# Altium schematic sheet headers.SchDoc
size B
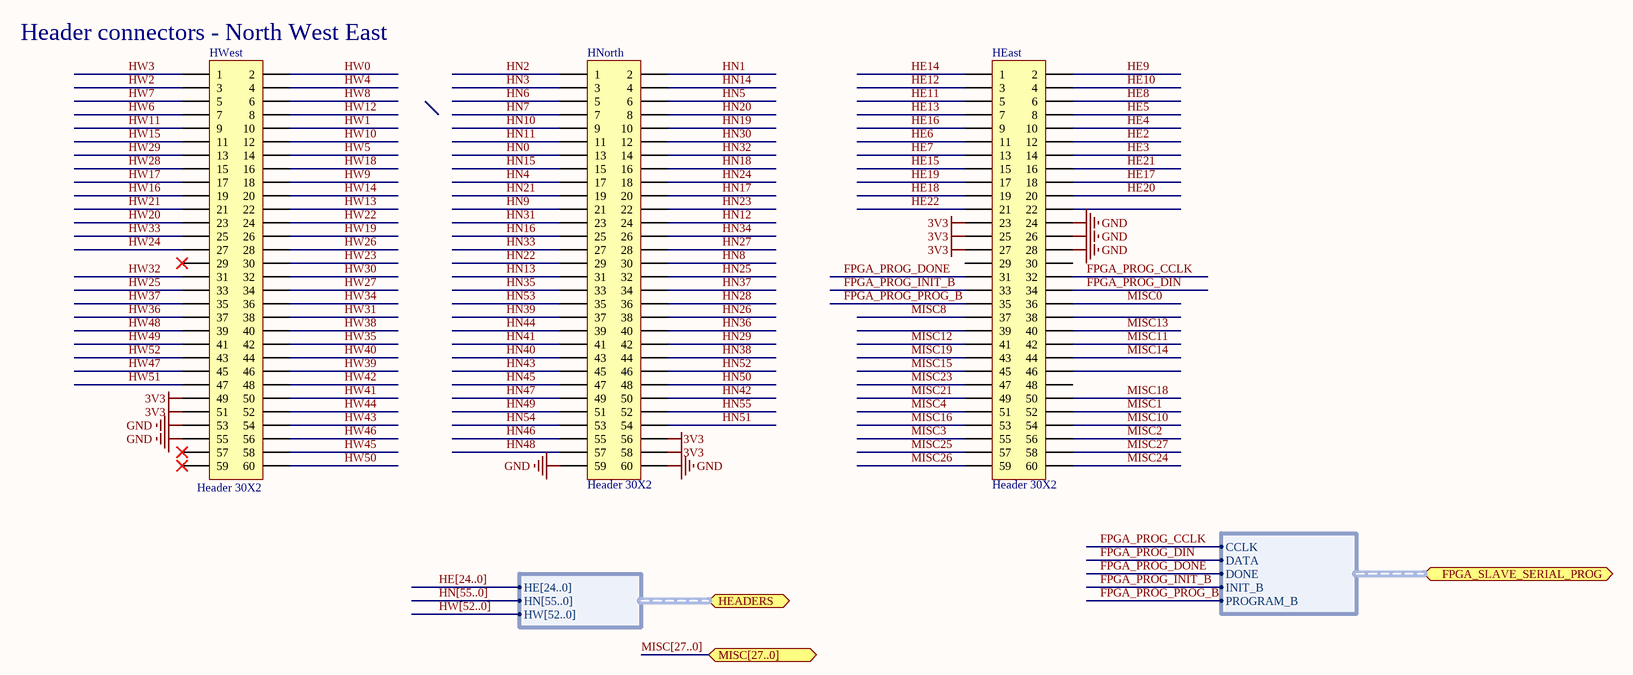
[diagram p0: headers.SchDoc]

## Parts
HEast  Header 30X2  [HDR2X30]
HNorth  Header 30X2  [HDR2X30]
HWest  Header 30X2  [HDR2X30]

## Ports
FPGA_SLAVE_SERIAL_PROG (harness FPGA_SLAVE_SERIAL_PROG), HEADERS (harness HEADERS), MISC[27..0]

## Harnesses
HEADERS: HE[24..0], HN[55..0], HW[52..0]
FPGA_SLAVE_SERIAL_PROG: CCLK, DATA, DONE, INIT_B, PROGRAM_B

## Nets
3V3: HEast.23 HEast.25 HEast.27 HNorth.56 HNorth.58 HWest.49 HWest.51
GND: HEast.24 HEast.26 HEast.28 HNorth.59 HNorth.60 HWest.53 HWest.55
FPGA_PROG_CCLK: HEast.32 ; port FPGA_SLAVE_SERIAL_PROG.CCLK
FPGA_PROG_DIN: HEast.34 ; port FPGA_SLAVE_SERIAL_PROG.DATA
FPGA_PROG_DONE: HEast.31 ; port FPGA_SLAVE_SERIAL_PROG.DONE
FPGA_PROG_INIT_B: HEast.33 ; port FPGA_SLAVE_SERIAL_PROG.INIT_B
FPGA_PROG_PROG_B: HEast.35 ; port FPGA_SLAVE_SERIAL_PROG.PROGRAM_B
HE2: HEast.12
HE3: HEast.14
HE4: HEast.10
HE5: HEast.8
HE6: HEast.11
HE7: HEast.13
HE8: HEast.6
HE9: HEast.2
HE10: HEast.4
HE11: HEast.5
HE12: HEast.3
HE13: HEast.7
HE14: HEast.1
HE15: HEast.15
HE16: HEast.9
HE17: HEast.18
HE18: HEast.19
HE19: HEast.17
HE20: HEast.20
HE21: HEast.16
HE22: HEast.21
HN0: HNorth.13
HN1: HNorth.2
HN2: HNorth.1
HN3: HNorth.3
HN4: HNorth.17
HN5: HNorth.6
HN6: HNorth.5
HN7: HNorth.7
HN8: HNorth.30
HN9: HNorth.21
HN10: HNorth.9
HN11: HNorth.11
HN12: HNorth.24
HN13: HNorth.31
HN14: HNorth.4
HN15: HNorth.15
HN16: HNorth.25
HN17: HNorth.20
HN18: HNorth.16
HN19: HNorth.10
HN20: HNorth.8
HN21: HNorth.19
HN22: HNorth.29
HN23: HNorth.22
HN24: HNorth.18
HN25: HNorth.32
HN26: HNorth.38
HN27: HNorth.28
HN28: HNorth.36
HN29: HNorth.42
HN30: HNorth.12
HN31: HNorth.23
HN32: HNorth.14
HN33: HNorth.27
HN34: HNorth.26
HN35: HNorth.33
HN36: HNorth.40
HN37: HNorth.34
HN38: HNorth.44
HN39: HNorth.37
HN40: HNorth.43
HN41: HNorth.41
HN42: HNorth.50
HN43: HNorth.45
HN44: HNorth.39
HN45: HNorth.47
HN46: HNorth.55
HN47: HNorth.49
HN48: HNorth.57
HN49: HNorth.51
HN50: HNorth.48
HN51: HNorth.54
HN52: HNorth.46
HN53: HNorth.35
HN54: HNorth.53
HN55: HNorth.52
HW0: HWest.2
HW1: HWest.10
HW2: HWest.3
HW3: HWest.1
HW4: HWest.4
HW5: HWest.14
HW6: HWest.7
HW7: HWest.5
HW8: HWest.6
HW9: HWest.18
HW10: HWest.12
HW11: HWest.9
HW12: HWest.8
HW13: HWest.22
HW14: HWest.20
HW15: HWest.11
HW16: HWest.19
HW17: HWest.17
HW18: HWest.16
HW19: HWest.26
HW20: HWest.23
HW21: HWest.21
HW22: HWest.24
HW23: HWest.30
HW24: HWest.27
HW25: HWest.33
HW26: HWest.28
HW27: HWest.34
HW28: HWest.15
HW29: HWest.13
HW30: HWest.32
HW31: HWest.38
HW32: HWest.31
HW33: HWest.25
HW34: HWest.36
HW35: HWest.42
HW36: HWest.37
HW37: HWest.35
HW38: HWest.40
HW39: HWest.46
HW40: HWest.44
HW41: HWest.50
HW42: HWest.48
HW43: HWest.54
HW44: HWest.52
HW45: HWest.58
HW46: HWest.56
HW47: HWest.45
HW48: HWest.39
HW49: HWest.41
HW50: HWest.60
HW51: HWest.47
HW52: HWest.43
MISC0: HEast.36
MISC1: HEast.52
MISC2: HEast.56
MISC3: HEast.55
MISC4: HEast.51
MISC8: HEast.37
MISC10: HEast.54
MISC11: HEast.42
MISC12: HEast.41
MISC13: HEast.40
MISC14: HEast.44
MISC15: HEast.45
MISC16: HEast.53
MISC18: HEast.50
MISC19: HEast.43
MISC21: HEast.49
MISC23: HEast.47
MISC24: HEast.60
MISC25: HEast.57
MISC26: HEast.59
MISC27: HEast.58

Not connected (* = marked no-connect by the designer): HEast 22 29 30 38 39 46 48; HWest 29* 57* 59*

## Buses and harness runs
bus HE[24..0]
bus HN[55..0]
bus HW[52..0]
bus MISC[27..0] = port MISC[27..0]

## Notes on the sheet
- (near HWest) Header connectors - North West East

## Library data of the parts
HEast HNorth HWest = Header 30X2: Header, 30-Pin, Dual row; LatestRevisionDate: 17-Jul-2002; LatestRevisionNote: Re-released for DXP Platform.; Publisher: Altium Limited